# Altium schematic sheet unused.SchDoc
size A4
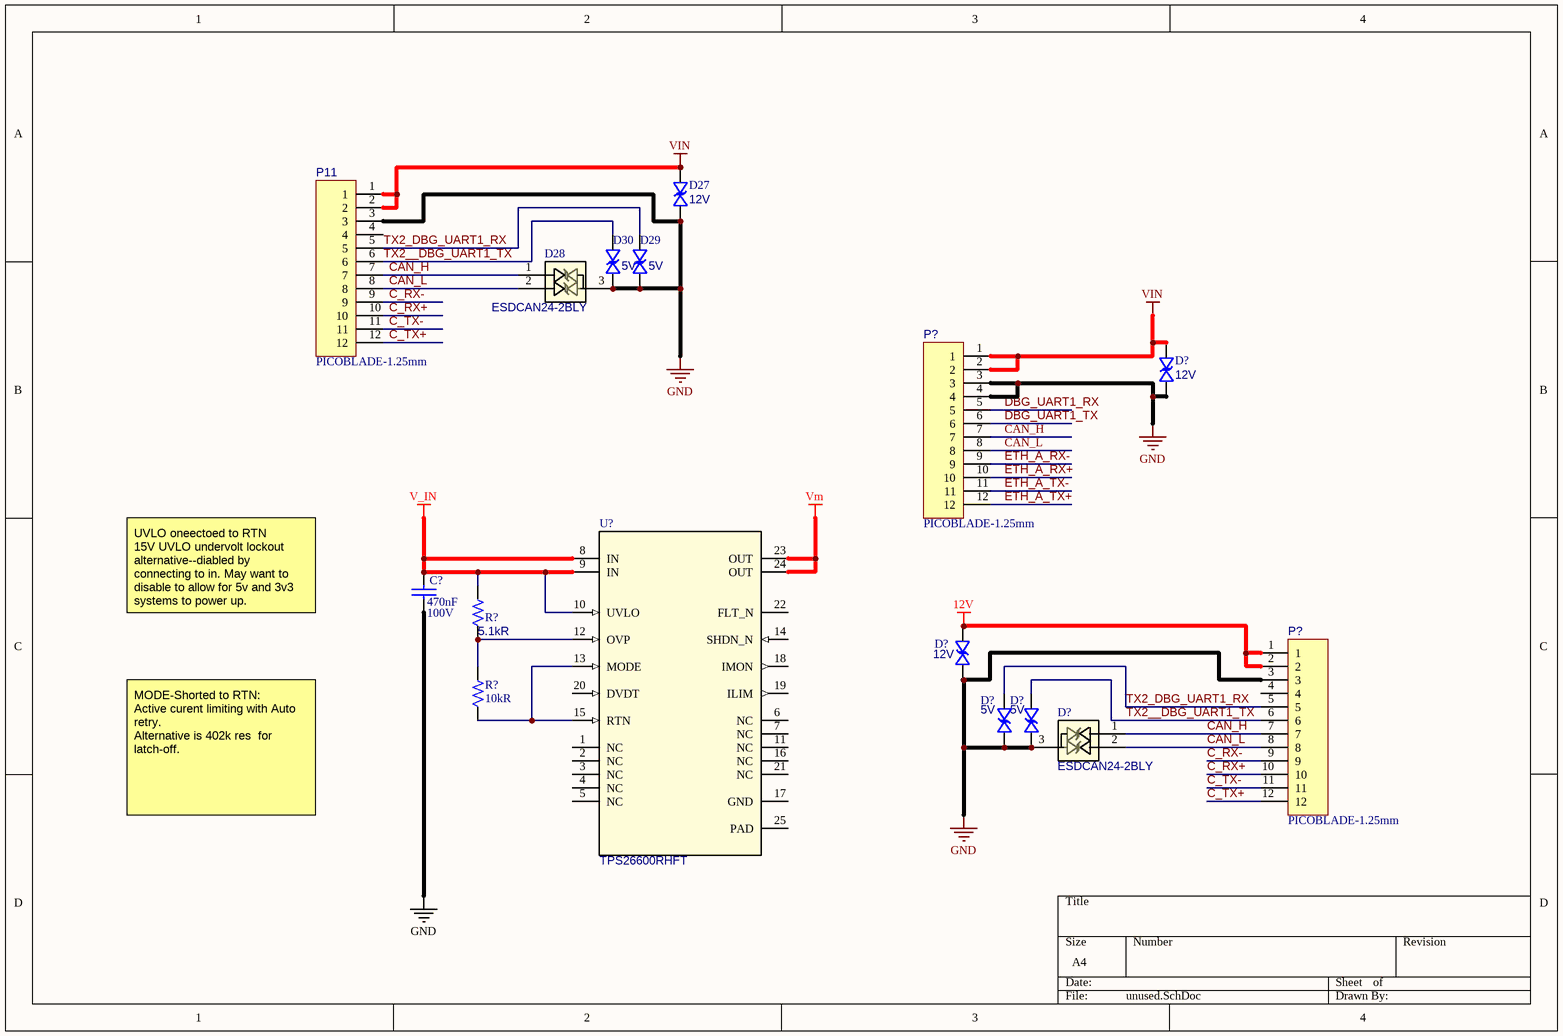
[diagram p0: unused.SchDoc]

## Parts
(Parts that share a designator on the sheet are numbered #1, #2 ... from top to bottom, then left to right.)
C?  Capacitance: 470nF  Voltage Rating: 100V  [CAP0805]  (hidden comment: Capacitor)
D27  Working Voltage: 12V  [SLP1006P2T]  (hidden comment: TVS-Bidirectional)
D28  Manufacturer Part Number 1: ESDCAN24-2BLY  [SOT23-BAT54]  (hidden comment: TVS- 3-pin)
D29  Reverse Standoff Voltage: 5V  [SLP1006P2T]  (hidden comment: TVS-Bidirectional)
D30  Reverse Standoff Voltage: 5V  [SLP1006P2T]  (hidden comment: TVS-Bidirectional)
D?#1  Working Voltage: 12V  [SLP1006P2T]  (hidden comment: TVS-Bidirectional)
D?#2  Working Voltage: 12V  [SLP1006P2T]  (hidden comment: TVS-Bidirectional)
D?#3  Reverse Standoff Voltage: 5V  [SLP1006P2T]  (hidden comment: TVS-Bidirectional)
D?#4  Reverse Standoff Voltage: 5V  [SLP1006P2T]  (hidden comment: TVS-Bidirectional)
D?#5  Manufacturer Part Number 1: ESDCAN24-2BLY  [SOT23-BAT54]  (hidden comment: TVS- 3-pin)
P11  PICOBLADE-1.25mm  [532617012]
P?#1  PICOBLADE-1.25mm  [532617012]
P?#2  PICOBLADE-1.25mm  [532617012]
R?#1  Resistance: 5.1kR  [RES0805]  (hidden comment: Resistor)
R?#2  Resistance: 10kR  [RES0402]  (hidden comment: Resistor)
U?  IC PWR MGMT EFUSE 60V 24VQFN  [TPS226600-24-VQFN]  (value not drawn)

## Nets
12V: D?#2.2 P?#2.1 P?#2.2
GND: C?.2 D27.1 D28.3 D29.2 D30.2 D?#1.1 D?#2.1 D?#3.2 D?#4.2 D?#5.3 P11.3 P?#1.3 P?#1.4 P?#2.3
V_IN: C?.1 R?#1.2 U?.8(IN) U?.9(IN) U?.10(UVLO)
VIN: D27.2 D?#1.2 P11.1 P11.2 P?#1.1 P?#1.2
Vm: U?.23(OUT) U?.24(OUT)
C_RX+: P11.10 P?#2.10
C_RX-: P11.9 P?#2.9
C_TX+: P11.12 P?#2.12
C_TX-: P11.11 P?#2.11
CAN_H: D28.1 D?#5.1 P11.7 P?#1.7 P?#2.7
CAN_L: D28.2 D?#5.2 P11.8 P?#1.8 P?#2.8
DBG_UART1_RX: P?#1.5
DBG_UART1_TX: P?#1.6
ETH_A_RX+: P?#1.10
ETH_A_RX-: P?#1.9
ETH_A_TX+: P?#1.12
ETH_A_TX-: P?#1.11
TX2__DBG_UART1_TX: D30.1 D?#4.1 P11.6 P?#2.6
TX2_DBG_UART1_RX: D29.1 D?#3.1 P11.5 P?#2.5
NetR?#1_1: R?#1.1 R?#2.2 U?.12(OVP)
NetR?#2_1: R?#2.1 U?.13(MODE) U?.15(RTN)

Not connected (* = marked no-connect by the designer): P11 4; P?#2 4; U? 1(NC) 2(NC) 3(NC) 4(NC) 5(NC) 6(NC) 7(NC) 11(NC) 14(SHDN_N) 16(NC) 17(GND) 18(IMON) 19(ILIM) 20(DVDT) 21(NC) 22(FLT_N) 25(PAD)

## Notes on the sheet
- UVLO oneectoed to RTN
  15V UVLO undervolt lockout
  alternative--diabled by connecting to in. May want to disable to allow for 5v and 3v3 systems to power up.
- MODE-Shorted to RTN:
  Active curent limiting with Auto retry.
  Alternative is 402k res  for latch-off.

## Library data of the parts
C? = Capacitor: Manufacturer 1: Murata; Manufacturer Part Number 1: GRM21BR72A474KA73L; Material: Ceramic; Dielectric: X7R; Manufacturer: *; Manufacturer Part Number: *; Supplier: *; Supplier Part Number: *; Tolerance: *; Voltage: *; Footprint: *; Temperature Coefficient: *; Supplier 1: Digi-Key; Supplier Part Number 1: 490-3326-1-ND; Stock 1: 259019; Pricing 1: 1=0,73000, 10=0,51300, 100=0,33770, 500=0,25016, 1000=0,21264 (USD); RoHS: Yes; Mount: Surface Mount; Case/Package: 0805; Case Code (Imperial): 0805; Case Code (Metric): 2012; Min Operating Temperature: -55°C; Max Operating Temperature: 125°C; Voltage Rating (DC): 100V; Packaging: Tape and Reel; Package Quantity: 1; Termination: SMD/SMT; Length: 2mm; Height: 1.25mm; Width: 1.25mm; Thickness: 0.053inch; Depth: 1.25mm; Radiation Hardening: No; REACH SVHC: No SVHC; Lead Free: Lead Free; ComponentLink1URL: https://datasheet.ciiva.com/140/grm21br72a474ka73-140555.pdf?src-supplier=Digi-Key; ComponentLink1Description: https://datasheet.ciiva.com/140/grm21br72a474ka73-140555.pdf?src-supplier=Digi-Key; ComponentLink2URL: https://datasheet.ciiva.com/3777/247grm21br72a474ka7323-3777925.pdf?src-supplier=Arrow; ComponentLink2Description: https://datasheet.ciiva.com/3777/247grm21br72a474ka7323-3777925.pdf?src-supplier=Arrow; ComponentLink3URL: https://datasheet.ciiva.com/140/grm21br72a474ka73-140556.pdf?src-supplier=Digi-Key; ComponentLink3Description: https://datasheet.ciiva.com/140/grm21br72a474ka73-140556.pdf?src-supplier=Digi-Key; ComponentLink4URL: https://datasheet.ciiva.com/11621/product-11621821.pdf?src-supplier=Avnet; ComponentLink4Description: https://datasheet.ciiva.com/11621/product-11621821.pdf?src-supplier=Avnet; ComponentLink5URL: https://datasheet.ciiva.com/16440/product-16440636.pdf?src-supplier=Future+Electronics; ComponentLink5Description: https://datasheet.ciiva.com/16440/product-16440636.pdf?src-supplier=Future+Electronics
D27 D?#1 D?#2 = TVS-Bidirectional: TVS DIODE 12V 27V SLP1006P2T; Manufacturer 1: Semtech; Manufacturer Part Number 1: UCLAMP1211T.TCT; Element Configuration: Single; Peak Pulse Current: 1A; Number of Bidirectional Channels: 1; Min Breakdown Voltage: 13.3V; Power Line Protection: No; Leakage Current: 50nA; Supplier 1: Digi-Key; Supplier Part Number 1: UCLAMP1211T.TCTCT-ND; RoHS: Yes; Category: TVS Diodes; Stock 1: 75056; Pricing 1: 1=0,68000, 10=0,59400, 100=0,40500, 500=0,33840, 1000=0,28800 (USD); Mount: Surface Mount; Case/Package: 0402; Number of Pins: 2; Case Code (Imperial): 0402; Case Code (Metric): 1006; Min Operating Temperature: -55°C; Max Operating Temperature: 125°C; Direction: Bidirectional; Clamping Voltage: 27V; Package Quantity: 3000; Packaging: Tape and Reel; Resistor Type: Zener; Reverse Standoff Voltage: 12V; Length: 1mm; Depth: 0.6mm; Radiation Hardening: No; ComponentLink1URL: https://datasheet.ciiva.com/29587/uclamp1211t-29587782.pdf?src-supplier=Digi-Key; ComponentLink1Description: https://datasheet.ciiva.com/29587/uclamp1211t-29587782.pdf?src-supplier=Digi-Key; ComponentLink2URL: https://datasheet.ciiva.com/45262/uclamp1211t-45262805.pdf?src-supplier=Digi-Key; ComponentLink2Description: https://datasheet.ciiva.com/45262/uclamp1211t-45262805.pdf?src-supplier=Digi-Key; ComponentLink3URL: https://datasheet.ciiva.com/11195/uclamp1211t-11195113.pdf?src-supplier=Avnet; ComponentLink3Description: https://datasheet.ciiva.com/11195/uclamp1211t-11195113.pdf?src-supplier=Avnet
D28 D?#5 = TVS- 3-pin: ESD Suppressor TVS 24V Automotive 3-Pin SOT-23 T/R; Manufacturer 1: STMicroelectronics; Direction: Bidirectional; Capacitance: 30pF; Number of Channels: 2; Breakdown Voltage: 27V; Clamping Voltage: 43V; Max Power Dissipation: 230W; Min Breakdown Voltage: 26.2V; Power Line Protection: No; Leakage Current: 100nA; ESD Protection: Yes; Element Configuration: Dual; Peak Pulse Current: 5.5A; Diode Type: ZENER; Supplier 1: Digi-Key; Supplier Part Number 1: 497-13262-1-ND; RoHS: Yes; Category: TVS Diodes; Stock 1: 51547; Pricing 1: 1=0,40000, 10=0,31000, 100=0,18570, 500=0,17198, 1000=0,12980 (USD); Mount: Surface Mount; Case/Package: SOT-23; Number of Pins: 3; Min Operating Temperature: -40°C; Max Operating Temperature: 150°C; Packaging: Tape and Reel; Package Quantity: 1; Polarity: Bidirectional; Termination: SMD/SMT; Working Voltage: 24V; Number of Bidirectional Channels: 2; Reverse Standoff Voltage: 24V; Peak Pulse Power: 230W; Max Reverse Leakage Current: 100nA; Resistor Type: Zener; Series: Automotive, AEC-Q101, ESDCAY, TRANSIL™; Length: 2.9mm; Width: 1.75mm; Height: 1.4mm; Depth: 1.3mm; Radiation Hardening: No; REACH SVHC: No SVHC; Lead Free: Lead Free; RoHS Compliant: Yes; ComponentLink1URL: https://datasheet.ciiva.com/22685/1786030-22685811.pdf?src-supplier=Element14; ComponentLink1Description: https://datasheet.ciiva.com/22685/1786030-22685811.pdf?src-supplier=Element14; ComponentLink2URL: https://datasheet.ciiva.com/26935/getdatasheetpartid-779627-26935935.pdf?src-supplier=Verical; ComponentLink2Description: https://datasheet.ciiva.com/26935/getdatasheetpartid-779627-26935935.pdf?src-supplier=Verical; ComponentLink3URL: https://datasheet.ciiva.com/23803/dm00037599-23803632.pdf?src-supplier=Newark; ComponentLink3Description: https://datasheet.ciiva.com/23803/dm00037599-23803632.pdf?src-supplier=Newark; ComponentLink4URL: https://datasheet.ciiva.com/12070/dm00037599-100424-12070821.pdf?src-supplier=Mouser; ComponentLink4Description: https://datasheet.ciiva.com/12070/dm00037599-100424-12070821.pdf?src-supplier=Mouser; ComponentLink5URL: https://datasheet.ciiva.com/6574/dm00037599-6574397.pdf?src-supplier=Digi-Key; ComponentLink5Description: https://datasheet.ciiva.com/6574/dm00037599-6574397.pdf?src-supplier=Digi-Key; ComponentLink6URL: https://datasheet.ciiva.com/6574/dm00037599-6574398.pdf?src-supplier=Digi-Key; ComponentLink6Description: https://datasheet.ciiva.com/6574/dm00037599-6574398.pdf?src-supplier=Digi-Key; ComponentLink7URL: https://datasheet.ciiva.com/16581/dm00037599-16581999.pdf?src-supplier=Avnet+Europe; ComponentLink7Description: https://datasheet.ciiva.com/16581/dm00037599-16581999.pdf?src-supplier=Avnet+Europe; ComponentLink8URL: https://datasheet.ciiva.com/41443/001183991-da-01-en-tvs-diode-24-esdcan24-2bly-sot-23-3l-stm-41443402.pdf?src-supplier=Conrad; ComponentLink8Description: https://datasheet.ciiva.com/41443/001183991-da-01-en-tvs-diode-24-esdcan24-2bly-sot-23-3l-stm-41443402.pdf?src-supplier=Conrad
D29 D30 D?#3 D?#4 = TVS-Bidirectional: TVS DIODE 5V 20V SLP1006P2T; Manufacturer 1: Semtech; Manufacturer Part Number 1: RCLAMP0531TQTCT; Peak Pulse Current: 4A; Element Configuration: Single; Number of Bidirectional Channels: 1; Min Breakdown Voltage: 6V; Peak Pulse Power: 80W; Power Line Protection: No; Leakage Current: 100nA; Supplier 1: Digi-Key; Supplier Part Number 1: RCLAMP0531TQTCTCT-ND; RoHS: Yes; Category: TVS Diodes; Stock 1: 9000; Pricing 1: 1=1,09000, 10=0,97400, 100=0,69300, 500=0,58740, 1000=0,47850 (USD); Mount: Surface Mount; Case/Package: 0402; Number of Pins: 2; Case Code (Imperial): 0402; Case Code (Metric): 1006; Min Operating Temperature: -40°C; Max Operating Temperature: 125°C; Direction: Bidirectional; Packaging: Tape and Reel; Package Quantity: 3000; Resistor Type: Zener; Clamping Voltage: 20V; Working Voltage: 5V; Length: 1mm; Depth: 0.6mm; Radiation Hardening: No; Lead Free: Lead Free; ComponentLink1URL: https://datasheet.ciiva.com/26946/getdatasheetpartid-791156-26946873.pdf?src-supplier=Verical; ComponentLink1Description: https://datasheet.ciiva.com/26946/getdatasheetpartid-791156-26946873.pdf?src-supplier=Verical; ComponentLink2URL: https://datasheet.ciiva.com/29574/rclamp0531tq-29574060.pdf?src-supplier=Digi-Key; ComponentLink2Description: https://datasheet.ciiva.com/29574/rclamp0531tq-29574060.pdf?src-supplier=Digi-Key
P11 P?#1 P?#2 = 532611271: Conn.;  Rect/PCB;  Header;  W-to-B;  1.25mmPitch;  12 Cir.; SMT;  Rt. Angle;  PicoBlade; Manufacturer 1: Molex; Manufacturer Part Number 1: 53261-1271; Body Plating: Tin; Contact Resistance: 20mR; Current Rating: 1A; Voltage Rating: 125V; Number of Positions: 12; Insulation Resistance: 100MR; Gender: Male; Pitch: 1.25mm; Glow Wire Compliant: Non-compliant; Supplier 1: Digi-Key; RoHS: Yes; Category: Headers and Wire Housings; Stock 1: 3806; Pricing 1: 1=1,08000, 10=0,89000, 100=0,74200 (USD); Mount: Surface Mount; Contact Plating: Tin; Contact Material: Bronze,Tin,Brass; Color: Natural; Housing Material: Nylon; Housing Color: Natural; Min Operating Temperature: -40°C; Max Operating Temperature: 85°C; Number of Rows: 1; Package Quantity: 1000; Packaging: Tape and Reel; Voltage Rating (AC): 125V; Termination: Solder; Number of Contacts: 12; Working Voltage: 125V; Orientation: Right Angle; Voltage Rating (DC): 125V; Number of Circuits: 12; Series: PicoBlade; Contact Type: Blade Pin; Lead Pitch: 1.25mm; Depth: 5.2mm; Radiation Hardening: No; RoHS Compliant: Yes; REACH SVHC: Unknown; Lead Free: Lead Free; ComponentLink1URL: https://datasheet.ciiva.com/22704/1841148-22704823.pdf?src-supplier=Element14; ComponentLink1Description: https://datasheet.ciiva.com/22704/1841148-22704823.pdf?src-supplier=Element14; ComponentLink2URL: https://datasheet.ciiva.com/16657/0532611271-pcb-headers-16657841.pdf?src-supplier=Avnet+Europe; ComponentLink2Description: https://datasheet.ciiva.com/16657/0532611271-pcb-headers-16657841.pdf?src-supplier=Avnet+Europe; ComponentLink3URL: https://datasheet.ciiva.com/5156/0532611271-pcb-headers-256968-5156358.pdf?src-supplier=Mouser; ComponentLink3Description: https://datasheet.ciiva.com/5156/0532611271-pcb-headers-256968-5156358.pdf?src-supplier=Mouser; ComponentLink4URL: https://datasheet.ciiva.com/11749/0900766b8078fc82-11749268.pdf?src-supplier=RSComponents; ComponentLink4Description: https://datasheet.ciiva.com/11749/0900766b8078fc82-11749268.pdf?src-supplier=RSComponents; ComponentLink5URL: https://datasheet.ciiva.com/7814/1739297-7814874.pdf?src-supplier=Element14; ComponentLink5Description: https://datasheet.ciiva.com/7814/1739297-7814874.pdf?src-supplier=Element14; ComponentLink6URL: https://datasheet.ciiva.com/14488/1768013-14488444.pdf?src-supplier=Farnell; ComponentLink6Description: https://datasheet.ciiva.com/14488/1768013-14488444.pdf?src-supplier=Farnell; ComponentLink7URL: https://datasheet.ciiva.com/10083/0532611271-pcb-headers-10083068.pdf?src-supplier=Avnet; ComponentLink7Description: https://datasheet.ciiva.com/10083/0532611271-pcb-headers-10083068.pdf?src-supplier=Avnet; Supplier Part Number 1: WM7630CT-ND
R?#1 = Resistor: YAGEO - RC0402FR-075K1L - RES, THICK FILM, 5K1, 1%, 0.0625W, 0402, REEL; Power Rating: 63mW; Temperature Coefficient: 100ppm/°C; Voltage Rating: 50V; Supplier 1: Digi-Key; Supplier Part Number 1: 311-5.10KLRCT-ND; Manufacturer 1: Yageo; Manufacturer Part Number 1: RC0402FR-075K1L; RoHS: Yes; Category: Chip SMD Resistors; Stock 1: 1450799; Pricing 1: 1=0,10000, 10=0,01600, 100=0,00640, 1000=0,00286, 2500=0,00248, 5000=0,00205 (USD); Case/Package: 0402; Case Code (Metric): 1005; Case Code (Imperial): 0402; Min Operating Temperature: -55°C; Max Operating Temperature: 155°C; Tolerance: 1%; Technology: THICK FILM; Packaging: Tape and Reel; Package Quantity: 1; Resistor Type: Thick Film; Number of Terminations: 2; Termination: SMD/SMT; Max Power Dissipation: 63mW; Voltage Rating (DC): 50V; Working Voltage: 50V; Features: Moisture Resistant; Series: RC; Resistance Tolerance: 1%; Construction: Rectangular; Length: 1mm; Width: 0.02inch; Height: 0.016inch; Depth: 0.5mm; RoHS Compliant: Yes; REACH SVHC: Unknown; Military Standard: Not; Lead Free: Lead Free; ComponentLink1URL: https://datasheet.ciiva.com/15189/getdatasheetpartid-323636-15189493.pdf?src-supplier=Verical; ComponentLink1Description: https://datasheet.ciiva.com/15189/getdatasheetpartid-323636-15189493.pdf?src-supplier=Verical; ComponentLink2URL: https://datasheet.ciiva.com/2453/pyu-r-int-thick-7-2453400.pdf?src-supplier=Digi-Key; ComponentLink2Description: https://datasheet.ciiva.com/2453/pyu-r-int-thick-7-2453400.pdf?src-supplier=Digi-Key; ComponentLink3URL: https://datasheet.ciiva.com/46394/1018594-46394936.pdf?src-supplier=Element14; ComponentLink3Description: https://datasheet.ciiva.com/46394/1018594-46394936.pdf?src-supplier=Element14; ComponentLink4URL: https://datasheet.ciiva.com/2453/pyu-r-int-thick-7-2453401.pdf?src-supplier=Digi-Key; ComponentLink4Description: https://datasheet.ciiva.com/2453/pyu-r-int-thick-7-2453401.pdf?src-supplier=Digi-Key; ComponentLink5URL: https://datasheet.ciiva.com/2453/pyu-r-int-thick-7-2453402.pdf?src-supplier=Digi-Key; ComponentLink5Description: https://datasheet.ciiva.com/2453/pyu-r-int-thick-7-2453402.pdf?src-supplier=Digi-Key; ComponentLink6URL: https://datasheet.ciiva.com/16744/pyu-rc0402-51-rohs-l-6-r-16744283.pdf?src-supplier=Future+Electronics; ComponentLink6Description: https://datasheet.ciiva.com/16744/pyu-rc0402-51-rohs-l-6-r-16744283.pdf?src-supplier=Future+Electronics; ComponentLink7URL: https://datasheet.ciiva.com/12558/pyu-rc0402-51-rohs-l-6-r-8721-12558460.pdf?src-supplier=Mouser; ComponentLink7Description: https://datasheet.ciiva.com/12558/pyu-rc0402-51-rohs-l-6-r-8721-12558460.pdf?src-supplier=Mouser; ComponentLink8URL: https://datasheet.ciiva.com/7983/1018594-7983519.pdf?src-supplier=Element14; ComponentLink8Description: https://datasheet.ciiva.com/7983/1018594-7983519.pdf?src-supplier=Element14
R?#2 = Resistor: Manufacturer 1: Panasonic; Manufacturer Part Number 1: ERJ-2RKF1002X; Power Rating: 100mW; Tolerance: 1%; Voltage Rating: 50V; Temperature Coefficient: 100ppm/°C; Supplier 1: Digi-Key; Supplier Part Number 1: P10.0KLDKR-ND; Stock 1: 3290329; Pricing 1: 1=0,10000, 10=0,04100, 100=0,01680, 1000=0,00753, 2500=0,00653, 5000=0,00540 (USD); RoHS: Yes; Mount: Surface Mount; Case/Package: 0402; Number of Pins: 2; Contact Plating: Tin; Case Code (Metric): 1005; Case Code (Imperial): 0402; Min Operating Temperature: -55°C; Max Operating Temperature: 155°C; Packaging: Tape and Reel; Package Quantity: 1; Voltage Rating (DC): 50V; Features: Automotive AEC-Q200; Max Power Dissipation: 100mW; Composition: Thick Film; Number of Terminations: 2; Termination: SMD/SMT; Military Standard: Not; Length: 1mm; Height: 0.35mm; Width: 0.02inch; Depth: 0.5mm; Radiation Hardening: No; Lead Free: Lead Free; REACH SVHC: No SVHC; ComponentLink1URL: https://datasheet.ciiva.com/11821/0900766b80f80784-11821171.pdf?src-supplier=RSComponents; ComponentLink1Description: https://datasheet.ciiva.com/11821/0900766b80f80784-11821171.pdf?src-supplier=RSComponents; ComponentLink2URL: https://datasheet.ciiva.com/16199/aoa0000ce2-16199478.pdf?src-supplier=Future+Electronics; ComponentLink2Description: https://datasheet.ciiva.com/16199/aoa0000ce2-16199478.pdf?src-supplier=Future+Electronics; ComponentLink3URL: https://datasheet.ciiva.com/17212/aoa0000ce2-17212102.pdf?src-supplier=Avnet+Europe; ComponentLink3Description: https://datasheet.ciiva.com/17212/aoa0000ce2-17212102.pdf?src-supplier=Avnet+Europe; ComponentLink4URL: https://datasheet.ciiva.com/24023/aoa0000ce2-24023017.pdf?src-supplier=Mouser; ComponentLink4Description: https://datasheet.ciiva.com/24023/aoa0000ce2-24023017.pdf?src-supplier=Mouser; ComponentLink5URL: https://datasheet.ciiva.com/28514/1678782-28514185.pdf?src-supplier=Element14; ComponentLink5Description: https://datasheet.ciiva.com/28514/1678782-28514185.pdf?src-supplier=Element14; ComponentLink6URL: https://datasheet.ciiva.com/43467/1678782-43467402.pdf?src-supplier=Farnell; ComponentLink6Description: https://datasheet.ciiva.com/43467/1678782-43467402.pdf?src-supplier=Farnell; ComponentLink7URL: https://datasheet.ciiva.com/27055/1987020-27055643.pdf?src-supplier=Jameco; ComponentLink7Description: https://datasheet.ciiva.com/27055/1987020-27055643.pdf?src-supplier=Jameco; ComponentLink8URL: https://datasheet.ciiva.com/48531/aoa0000ce2-48531069.pdf?src-supplier=Avnet; ComponentLink8Description: https://datasheet.ciiva.com/48531/aoa0000ce2-48531069.pdf?src-supplier=Avnet; ComponentLink9URL: https://datasheet.ciiva.com/9194/aoa0000ce2-9194142.pdf?src-supplier=Avnet; ComponentLink9Description: https://datasheet.ciiva.com/9194/aoa0000ce2-9194142.pdf?src-supplier=Avnet; ComponentLink10URL: https://datasheet.ciiva.com/16782/70260748-16782590.pdf?src-supplier=Allied+Electronics; ComponentLink10Description: https://datasheet.ciiva.com/16782/70260748-16782590.pdf?src-supplier=Allied+Electronics; ComponentLink11URL: https://datasheet.ciiva.com/16786/70260748-16786734.pdf?src-supplier=Allied+Electronics; ComponentLink11Description: https://datasheet.ciiva.com/16786/70260748-16786734.pdf?src-supplier=Allied+Electronics; ComponentLink12URL: https://datasheet.ciiva.com/30201/aoa0000ce2-30201022.pdf?src-supplier=Onlinecomponents.com; ComponentLink12Description: https://datasheet.ciiva.com/30201/aoa0000ce2-30201022.pdf?src-supplier=Onlinecomponents.com
U? = TPS26600RHFT: Manufacturer 1: Texas Instruments; Number of Channels: 1; Accuracy: 5%; Output Current: 2.35A; Supplier 1: Mouser; Manufacturer Part Number 1: TPS26600RHFT; RoHS: Yes; Category: Power Management ICs; Stock 1: 90; Pricing 1: 1=3,12000, 10=2,81000, 50=2,65000, 100=2,18000, 1000=1,95000, 10000=1,95000 (USD); Mount: Surface Mount; Case/Package: VQFN; Min Operating Temperature: -40°C; Max Operating Temperature: 125°C; Packaging: Tape and Reel; RoHS Compliant: Yes; ComponentLink1URL: http://www.ti.com/lit/ds/symlink/tps2660.pdf?src-supplier=Digi-Key; ComponentLink1Description: http://www.ti.com/lit/ds/symlink/tps2660.pdf?src-supplier=Digi-Key; ComponentLink2URL: http://www.ti.com/general/docs/lit/getliterature.tsp?genericPartNumber=TPS2660&fileType=pdf&src-supplier=Farnell; ComponentLink2Description: http://www.ti.com/general/docs/lit/getliterature.tsp?genericPartNumber=TPS2660&fileType=pdf&src-supplier=Farnell; Supplier Part Number 1: 595-TPS26600RHFT